# Altium project holographic_display_pcb_2.PrjPcb
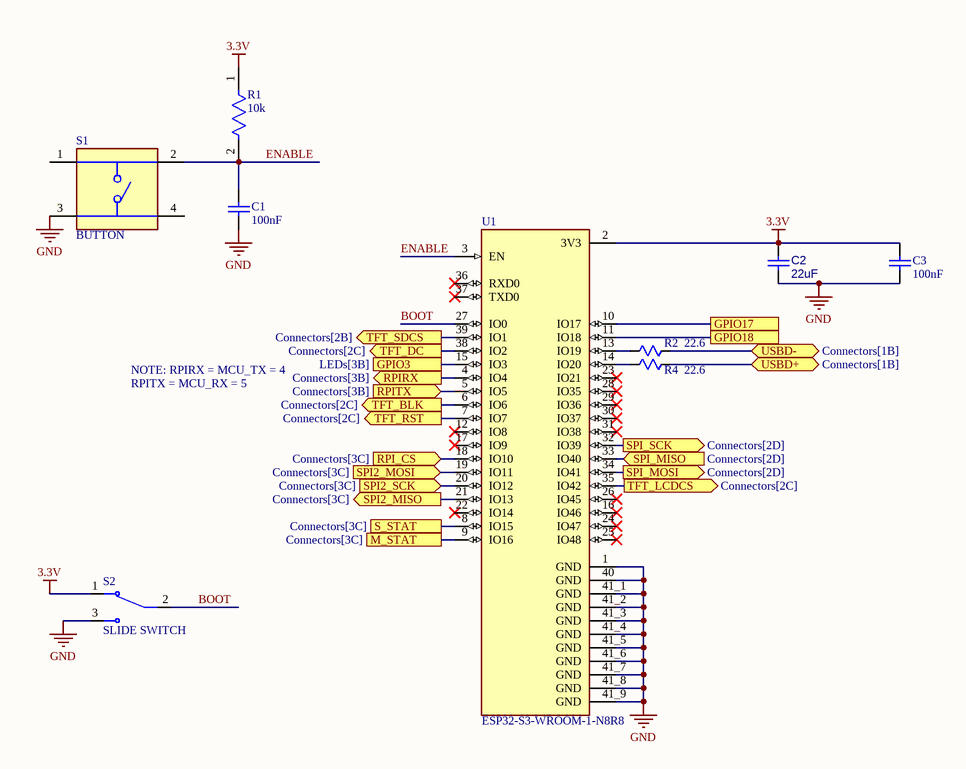
[diagram p0: MCU.SchDoc]
4 sheets, 32 parts. Net scope: flat (ports and power ports of the same name join across sheets).
Board files: PCB.PcbDoc, PCB1.PcbDoc
Sheets:
  MCU.SchDoc
  Connectors.SchDoc
  TLV62569.SchDoc
  LEDs.SchDoc

## Sheet MCU.SchDoc
size A; SheetNumber: 1; SheetTotal: 4

### Parts
C1  100nF  [CAPC1608X90X35LL10T15]
C2  22uF  [CAPC1608X09N]
C3  100nF  [CAPC1608X90X35LL10T15]
R1  10k  [FP-CRGP0603-IPC_C]
R2  22.6  [RESC1608X06N]
R4  22.6  [RESC1608X06N]
S1  BUTTON  [SW_TS02-66-43-BK-100-SCR-D]
S2  SLIDE SWITCH  [SW_SLW-883935-2A-D]
U1  ESP32-S3-WROOM-1-N8R8  [XCVR_ESP32S3WROOM1N8R8]

### Ports
GPIO3 (see LEDs[3B]), GPIO17, GPIO18, M_STAT (see Connectors[3C]), RPI_CS (in, see Connectors[3C]), RPIRX (out, see Connectors[3B]), RPITX (in, see Connectors[3B]), S_STAT (see Connectors[3C]), SPI2_MISO (out, see Connectors[3C]), SPI2_MOSI (in, see Connectors[3C]), SPI2_SCK (in, see Connectors[3C]), SPI_MISO (in, see Connectors[2D]), SPI_MOSI (out, see Connectors[2D]), SPI_SCK (out, see Connectors[2D]), TFT_BLK (out, see Connectors[2C]), TFT_DC (out, see Connectors[2C]), TFT_LCDCS (out, see Connectors[2C]), TFT_RST (out, see Connectors[2C]), TFT_SDCS (out, see Connectors[2B]), USBD+ (bidir, see Connectors[1B]), USBD- (bidir, see Connectors[1B])

### Nets
3.3V: C2.2 C3.2 R1.1 S2.1 U1.2(3V3)
GND: C1.1 C2.1 C3.1 S1.3 S2.3 U1.1(GND) U1.40(GND) U1.41_1(GND) U1.41_2(GND) U1.41_3(GND) U1.41_4(GND) U1.41_5(GND) U1.41_6(GND) U1.41_7(GND) U1.41_8(GND) U1.41_9(GND)
BOOT: S2.2 U1.27(IO0)
ENABLE: C1.2 R1.2 S1.2 U1.3(EN)
USB_D_N: R2.2 ; port USBD-
USB_D_P: R4.2 ; port USBD+
NetJ2_07: U1.5(IO5) ; port RPITX
NetJ2_09: U1.4(IO4) ; port RPIRX
NetJ2_17: U1.9(IO16) ; port M_STAT
NetJ2_20: U1.19(IO11) ; port SPI2_MOSI
NetJ2_21: U1.8(IO15) ; port S_STAT
NetJ2_22: U1.21(IO13) ; port SPI2_MISO
NetJ2_23: U1.18(IO10) ; port RPI_CS
NetJ2_24: U1.20(IO12) ; port SPI2_SCK
NetJ3_2: U1.39(IO1) ; port TFT_SDCS
NetJ3_11: U1.6(IO6) ; port TFT_BLK
NetJ3_12: U1.7(IO7) ; port TFT_RST
NetJ3_13: U1.38(IO2) ; port TFT_DC
NetJ3_14: U1.35(IO42) ; port TFT_LCDCS
NetJ3_15: U1.34(IO41) ; port SPI_MOSI
NetJ3_16: U1.33(IO40) ; port SPI_MISO
NetJ3_17: U1.32(IO39) ; port SPI_SCK
NetR2_1: R2.1 U1.13(IO19)
NetR4_1: R4.1 U1.14(IO20)
NetR10_1: U1.15(IO3) ; port GPIO3
NetU1_10: U1.10(IO17) ; port GPIO17
NetU1_11: U1.11(IO18) ; port GPIO18

Not connected (* = marked no-connect by the designer): S1 1 4; U1 12(IO8)* 16(IO46)* 17(IO9)* 22(IO14)* 23(IO21)* 24(IO47)* 25(IO48)* 26(IO45)* 28(IO35)* 29(IO36)* 30(IO37)* 31(IO38)* 36(RXD0)* 37(TXD0)*

### Notes on the sheet
- NOTE: RPIRX = MCU_TX = 4
- RPITX = MCU_RX = 5

### Library data of the parts
C1 C3 = CMP-2006-02868-1: Part Number: GRM188R71E104KA01D; Manufacturer: Murata
C2 = CMP-003-000012-1: CAP CER 22uF 10V X5R Symbols/Capacitor-Generic.SchLib; Part Number: CAP-0603-000010; Manufacturer Part Number 1: GRM187R61A226ME15#; Manufacturer 1: Murata; Value: 22µF; Tolerance: 20%; Voltage: 10V; Symbol Path: Symbols/Capacitor-Generic.SchLib; Temperature Characteristic: X5R
R1 = CMP-03211-004414-1: CRGP 0603 10K 1%; Manufacturer Part Number: CRGP0603F10K; Manufacturer: TE; Voltage Rating: 50V; Power Rating: 0.25W; Value: 10KΩ; Tolerance: 0.01; Temperature Coefficient: ±100ppm/°C; Octopart: https://octopart.com/crgp0603f10k-te+connectivity-91018721; Temperature Range Low: -55°C; Temperature Range High: +155°C; Device Class L3: Chip SMD Resistors; Package: CRGP0603; Height: 0.55mm; Series: CRGP; RoHS: TRUE; Composition: Thick Film; Digikey Description: CRGP 0603 10K 1%; Ipc Land Pattern Name: RESC16080X45; Mouser Description: Res, 10K, 1%, 0.25W, 0603, Thick Film; ComponentLink2Description: Datasheet; ComponentLink2URL: https://www.te.com/commerce/DocumentDelivery/DDEController?Action=srchrtrv&DocNm=9-1773463-9&DocType=DS&DocLang=English; Temperature: -55°C to +155°C; Device Class L1: Passive Components; Lead Free: Yes; Ambient Temperature Range High: +70°C; Device Class L2: Resistors; Automotive: No; Category: Res; Resistance: 10KΩ
R2 R4 = CMP-007-000132-1: RES 22.6 OHM 1% 1/10W 0603; Part Number: RES-0603-22R6-001; Manufacturer Part Number 1: RC0603FR-0722R6L; Manufacturer 1: Yageo; Value: 22.6R; Tolerance: 0.01%; Symbol Path: Symbols/Resistor_Generic.SchLib; Manufacturer 3: Vishay Dale; Manufacturer Part Number 3: CRCW060322R6FKED; Manufacturer 2: Stackpole Electronics; Manufacturer Part Number 2: RMCF0603FT22R6
S1 = CMP-00010-2: Switch Tactile OFF (ON) SPST Round Button PC Pins 0.05A 12VDC 100000Cycles 1N Thru-Hole Bag; Insulation Resistance: 100MΩ; Number of Positions: 1; Operating Force: 980mN; Electrical Life: 100kcycles; Max Current Rating: 50mA; Max Voltage Rating (DC): 12V; Min Operating Temperature: -30°C; Height: 3.5mm; Housing Material: Stainless Steel; Throw Configuration: SPST; Contact Plating: Silver; REACH SVHC: Yes; Lifecycle Status: Production; Terminal Material: Brass; Color: Black; Length: 6mm; Contact Resistance: 100mΩ; Max Operating Temperature: 80°C; Schedule B: 8536509030, 8536509065, 8536509065; RoHS: Compliant
S2 = CMP-00009-3: Switch Slide ON ON SPDT Raised Slide 0.5A 30VDC 10000Cycles PC Pins Thru-Hole Box; Number of Positions: 2; REACH SVHC: Yes; RoHS: Compliant; Lifecycle Status: Production
U1 = ESP32-S3-WROOM-1-N8R8: Bluetooth, WiFi 802.11b/g/n, Bluetooth v5.0 Transceiver Module 2.4GHz PCB Trace Surface Mount; MF: Espressif Systems; Package: None; Price: None; Check_prices: https://www.snapeda.com/parts/ESP32-S3-WROOM-1-N8R8/Espressif+Systems/view-part/?ref=eda; Value: *; SnapEDA_Link: https://www.snapeda.com/parts/ESP32-S3-WROOM-1-N8R8/Espressif+Systems/view-part/?ref=snap; MP: ESP32-S3-WROOM-1-N8R8; Availability: In Stock; Purchase-URL: https://pricing.snapeda.com/search?q=ESP32-S3-WROOM-1-N8R8&ref=eda

## Sheet Connectors.SchDoc
size A; SheetNumber: 2; SheetTotal: 4
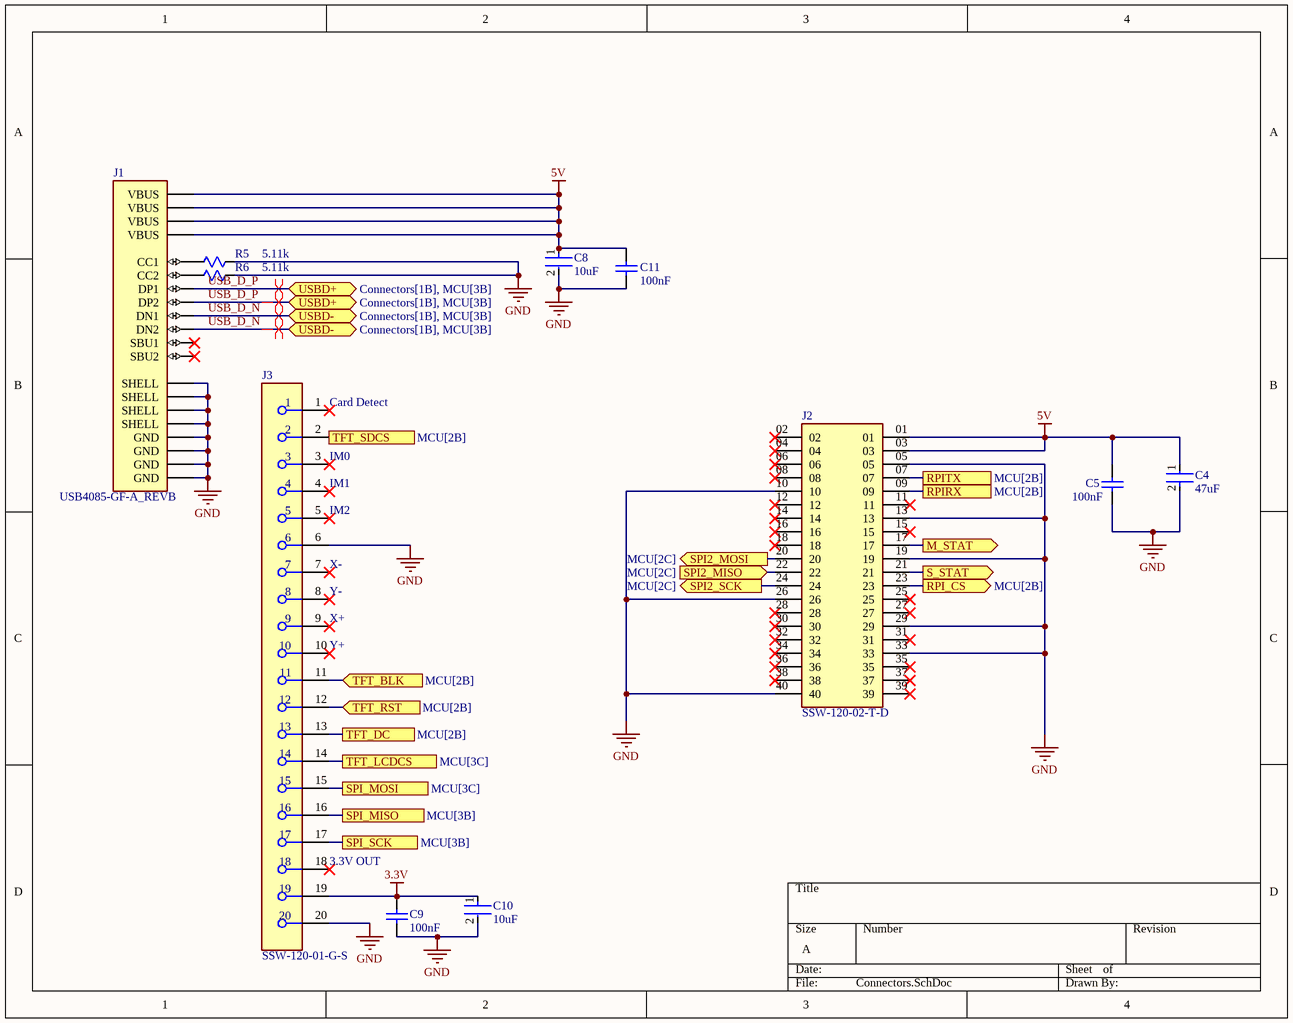
[diagram p1: Connectors.SchDoc]

### Parts
C4  47uF  [FP-GRM31C-0_3-e0_3_0_8-IPC_C]
C5  100nF  [CAPC1608X90X35LL10T15]
C8  10uF  [FP-GRM21B-0_1-IPC_C]
C9  100nF  [CAPC1608X90X35LL10T15]
C10  10uF  [FP-GRM21B-0_1-IPC_C]
C11  100nF  [CAPC1608X90X35LL10T15]
J1  USB4085-GF-A_REVB  [GCT_USB4085-GF-A_REVB]
J2  SSW-120-02-T-D  [SAMTEC_SSW-120-02-T-D]
J3  SSW-120-01-G-S  [FP-SSW-120-01-G-S-MFG]
R5  5.11k  [RESC1608X06N]
R6  5.11k  [RESC1608X06N]

### Ports
M_STAT (out), RPI_CS (out, see MCU[2B]), RPIRX (see MCU[2B]), RPITX (see MCU[2B]), S_STAT (out), SPI2_MISO (in, see MCU[2C]), SPI2_MOSI (out, see MCU[2C]), SPI2_SCK (out, see MCU[2C]), SPI_MISO (see MCU[3B]), SPI_MOSI (see MCU[3C]), SPI_SCK (see MCU[3B]), TFT_BLK (in, see MCU[2B]), TFT_DC (see MCU[2B]), TFT_LCDCS (see MCU[3C]), TFT_RST (in, see MCU[2B]), TFT_SDCS (see MCU[2B]), USBD+ (bidir, see Connectors[1B], MCU[3B]), USBD- (bidir, see Connectors[1B], MCU[3B])

### Nets
3.3V: C9.2 C10.1 J3.19
5V: C4.1 C5.2 C8.1 C11.2 J1.A4(VBUS) J1.A9(VBUS) J1.B4(VBUS) J1.B9(VBUS) J2.01 J2.03
GND: C4.2 C5.1 C8.2 C9.1 C10.2 C11.1 J1.A1(GND) J1.A12(GND) J1.B1(GND) J1.B12(GND) J1.S1(SHELL) J1.S2(SHELL) J1.S3(SHELL) J1.S4(SHELL) J2.05 J2.10 J2.13 J2.19 J2.26 J2.29 J2.33 J2.40 J3.6 J3.20 R5.2 R6.2
USB_D_N: J1.A7(DN1) J1.B7(DN2) ; port USBD-
USB_D_P: J1.A6(DP1) J1.B6(DP2) ; port USBD+
NetJ1_A5: J1.A5(CC1) R5.1
NetJ1_B5: J1.B5(CC2) R6.1
NetJ2_07: J2.07 ; port RPITX
NetJ2_09: J2.09 ; port RPIRX
NetJ2_17: J2.17 ; port M_STAT
NetJ2_20: J2.20 ; port SPI2_MOSI
NetJ2_21: J2.21 ; port S_STAT
NetJ2_22: J2.22 ; port SPI2_MISO
NetJ2_23: J2.23 ; port RPI_CS
NetJ2_24: J2.24 ; port SPI2_SCK
NetJ3_2: J3.2 ; port TFT_SDCS
NetJ3_11: J3.11 ; port TFT_BLK
NetJ3_12: J3.12 ; port TFT_RST
NetJ3_13: J3.13 ; port TFT_DC
NetJ3_14: J3.14 ; port TFT_LCDCS
NetJ3_15: J3.15 ; port SPI_MOSI
NetJ3_16: J3.16 ; port SPI_MISO
NetJ3_17: J3.17 ; port SPI_SCK

Not connected (* = marked no-connect by the designer): J1 A8(SBU1)* B8(SBU2)*; J2 02* 04* 06* 08* 11* 12* 14* 15* 16* 18* 25* 27* 28* 30* 31* 32* 34* 35* 36* 37* 38* 39*; J3 1* 3* 4* 5* 7* 8* 9* 10* 18*

### Layout directives
differential pair: USB_D_N, USB_D_P

### Notes on the sheet
- (near J3) Card Detect
- (near J3) IM0
- (near J3) IM1
- (near J3) IM2
- (near J3) X-
- (near J3) Y-
- (near J3) X+
- (near J3) Y+
- (near J3) 3.3V OUT

### Library data of the parts
C4 = CMP-06035-011430-1: Chip Multilayer Ceramic Capacitors for General Purpose, 1206, 47uF, X5R, 15%, 20%, 16V; Capacitance: 47uF; Length: 3.2mm; Thickness: 1.6mm; Width: 1.6mm; Voltage Rating (DC): 16V; Tolerance: 20%; Dielectric: X5R
C5 C9 C11 = CMP-2006-02868-1: as C1 on sheet MCU
C8 C10 = CMP-2007-03453-2: Chip Multilayer Ceramic Capacitors for General Purpose, 0805, 10uF, X5R, 15%, 10%, 16V; Radiation Hardening: No; Thickness: 0.053inch; Voltage Rating (DC): 16V; Lead Free: Lead Free; Package Quantity: 1; Width: 1.25mm; Case Code (Imperial): 0805; Depth: 1.25mm; Packaging: Tape and Reel; Dielectric: X5R; Max Operating Temperature: 85°C; Tolerance: 10%; Voltage Rating: 16V; Voltage: 16V; Capacitance: 10uF; Height: 1.25mm; Case Code (Metric): 2012; Material: Ceramic; Mount: Surface Mount; Case/Package: 0805; REACH SVHC: No SVHC; Length: 2mm; Min Operating Temperature: -55°C; Termination: SMD/SMT
J1 = USB4085-GF-A_REVB: USB-C (USB TYPE-C) USB 2.0 æ’åº§è¿žæŽ¥å™¨ 24 (16+8 Dummy) ä½é€šå­”ã€ç›´è§’ã€ä½Žæˆæœ¬ã€3.46mm å¤–å½¢ã€16 é’ˆã€æ°´å¹³ã€é¡¶éƒ¨å®‰è£…; MF: Global Connector Technology; SnapEDA_Link: https://www.snapeda.com/parts/USB4085-GF-A/Global+Connector+Technology/view-part/?ref=snap; Package: None; Value: *; MP: USB4085-GF-A; Check_prices: https://www.snapeda.com/parts/USB4085-GF-A/Global+Connector+Technology/view-part/?ref=eda
J2 = SSW-120-02-T-D: 40 Position Receptacle Connector 0.100 (2.54mm) Through Hole Tin; MF: Samtec Inc.; SnapEDA_Link: https://www.snapeda.com/parts/SSW-120-02-T-D/Samtec+Inc./view-part/?ref=snap; Package: None; Value: *; MP: SSW-120-02-T-D; Check_prices: https://www.snapeda.com/parts/SSW-120-02-T-D/Samtec+Inc./view-part/?ref=eda
J3 = CMP-00575-00296075-1: SSW-120-01-G-S SSW - Samtec 2.54mm Single Row Straight Socket Strip 8.5 Profile (mcv)(TO22); NexarPartId: 296075; Manufacturer Lifecycle Status: PRODUCTION; Number of Contacts: 20; Gender: Receptacle; Connector Type: Receptacle, Socket; Contact Resistance: 10mΩ; Voltage Rating: 550V; Voltage Rating (DC): 655V; Voltage Rating (AC): 465V; Current Rating: 6.9A; Lead Length: 2.64mm; Housing Material: Polymer; Lead Free: Lead Free; Depth: 2.41mm; Termination: Solder; Radiation Hardening: No; Contact Material: Bronze; Lead Pitch: 2.54mm; Number of Rows: 1; Orientation: Straight; Housing Color: Black; Max Voltage Rating (AC): 550V; RoHS: Compliant; Pitch: 2.54mm; Lifecycle Status: Production; Mount: Through Hole; Color: Black; REACH SVHC: No SVHC; Min Operating Temperature: -55°C; Contact Plating: Gold; Length: 51.31mm; Max Operating Temperature: 125°C; Max Current Rating: 6.9A; Number of Positions: 20
R5 R6 = CMP-007-000358-1: RES 5.11K OHM 1% 1/10W 0603; Manufacturer Part Number 1: RC0603FR-075K11L; Manufacturer 1: Yageo; Part Number: RES-0603-5K11-001; Tolerance: 0.01%; Manufacturer 2: Stackpole Electronics; Manufacturer Part Number 3: CRCW06035K11FKED; Manufacturer 3: Vishay Dale; Value: 5.11K; Symbol Path: Symbols/Resistor_Generic.SchLib; Manufacturer Part Number 2: RMCF0603FT5K11

## Sheet TLV62569.SchDoc
size A; SheetNumber: 3; SheetTotal: 4
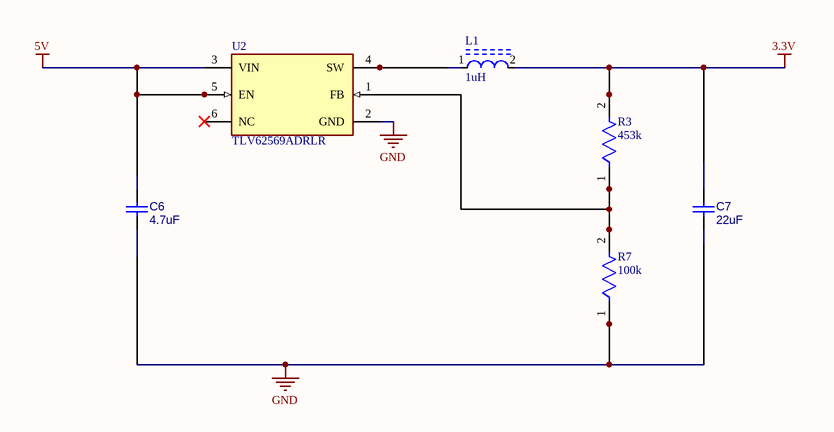
[diagram p2: TLV62569.SchDoc]

### Parts
C6  4.7uF  [CAPC1608X09N]
C7  22uF  [CAPC1608X09N]
L1  1uH  [FP-SRN8040-MFG]
R3  453k  [FP-CRCW0402-e3-MFG]
R7  100k  [FP-CRCW0402-e3-IPC_C]
U2  TLV62569ADRLR  [FP-DRL0006A-MFG]

### Nets
3.3V: C7.2 L1.2 R3.2
5V: C6.2 U2.3(VIN) U2.5(EN)
GND: C6.1 C7.1 R7.1 U2.2(GND)
NetL1_1: L1.1 U2.4(SW)
NetR3_1: R3.1 R7.2 U2.1(FB)

Not connected (* = marked no-connect by the designer): U2 6(NC)*

### Library data of the parts
C6 = CMP-003-000096-1: CAP CER 4.7uF 25V X5R Symbols/Capacitor-Generic.SchLib; Manufacturer 1: Murata; Manufacturer Part Number 1: GRM188R61E475KE11#; Part Number: CAP-0603-000094; Tolerance: 10%; Value: 4.7µF; Symbol Path: Symbols/Capacitor-Generic.SchLib; Voltage: 25V; Temperature Characteristic: X5R
C7 = CMP-003-000012-1: as C2 on sheet MCU; Voltage: 10V; Symbol Path: Symbols/Capacitor-Generic.SchLib; Temperature Characteristic: X5R
L1 = CMP-07248-000040-1: FIXED IND 1UH 7.8A 10 MOHM SMD; Inductance Tolerance: 30%; DC Resistance (DCR): 10mR; Self Resonant Frequency: 75MHz; Shielding: Shielded; Saturation Current: 11A; Core Material: Ferrite; Test Frequency: 100kHz; Current Rating: 7.8A; Composition: Wirewound; Height: 4mm; Number of Pins: 2; Inductance: 1uH; Depth: 8.3mm; REACH SVHC: No SVHC; Length: 8mm; DC Current: 7.8A; Package Quantity: 1000; Height - Seated (Max): 0.157inch; Termination: SMD/SMT; Packaging: Tape and Reel; Max DC Current: 7.8A; Min Operating Temperature: -40°C; Max Operating Temperature: 125°C; Case/Package: Nonstandard; Mount: Surface Mount; Military Standard: Not; RMS Current (Irms): 7.8A; Width: 8mm; Tolerance: 30%
R3 = CMP-2002-00012-2: RES Thick Film, 453kΩ, 1%, 0.063W, 100ppm/°C, 0402; Resistance: 453kR; Voltage Rating (DC): 50V; Power Rating: 63mW; Features: Automotive AEC-Q200; Termination: SMD/SMT; Weight: 2.3E-05oz; Resistor Type: Thick Film; Size Code: 0402; Height: 0.016inch; RoHS Compliant: Yes; Resistance Tolerance: 1%; Construction: Rectangular; Radiation Hardening: No; Temperature Coefficient: 100ppm/°C; Series: CRCW; Depth: 0.5mm; Lead Free: Lead Free; Min Operating Temperature: -55°C; Package Quantity: 10; Length: 1mm; Case Code (Metric): 1005; Tolerance: 1%; Max Operating Temperature: 155°C; Voltage Rating: 50V; Packaging: Tape and Reel; Number of Pins: 2; Case Code (Imperial): 0402; Case/Package: 0402; Number of Terminations: 2; Contact Plating: Tin; Military Standard: Not; Max Power Dissipation: 63mW; Width: 0.5mm
R7 = CMP-2002-08123-3: RES Thick Film, 100kΩ, 1%, 0.063W, 100ppm/°C, 0402; Power Rating: 63mW; Resistance: 100kR; Voltage Rating (DC): 50V; Lead Free: Lead Free; Height: 0.35mm; Contact Plating: Tin; Min Operating Temperature: -55°C; Package Quantity: 10000; Case/Package: 0402; Temperature Coefficient: 100ppm/°C; Number of Terminations: 2; Packaging: Tape and Reel; Max Power Dissipation: 63mW; Case Code (Metric): 1005; Mount: Surface Mount; Width: 0.02inch; Termination: SMD/SMT; Length: 1mm; Number of Pins: 2; Weight: 2.3E-05oz; Radiation Hardening: No; Tolerance: 1%; Military Standard: Not; Features: Automotive AEC-Q200; Depth: 0.5mm; Composition: Thick Film; Max Operating Temperature: 155°C; Voltage Rating: 50V; Case Code (Imperial): 0402
U2 = CMP-04918-000167-1: IC REG BUCK ADJ 2A SOT563; Synchronous Rectifier: Yes; Output Configuration: Positive; Max Output Voltage: 5.5V; Switching Frequency: 1.5MHz; Min Input Voltage: 2.5V; Output Type: Adjustable; Min Output Voltage: 600mV; Case/Package: SOT-563; Output Current: 2A; Max Input Voltage: 5.5V; Mount: Surface Mount; Max Operating Temperature: 125°C; Min Operating Temperature: -40°C; Packaging: Tape and Reel

## Sheet LEDs.SchDoc
size A; SheetNumber: 4; SheetTotal: 4
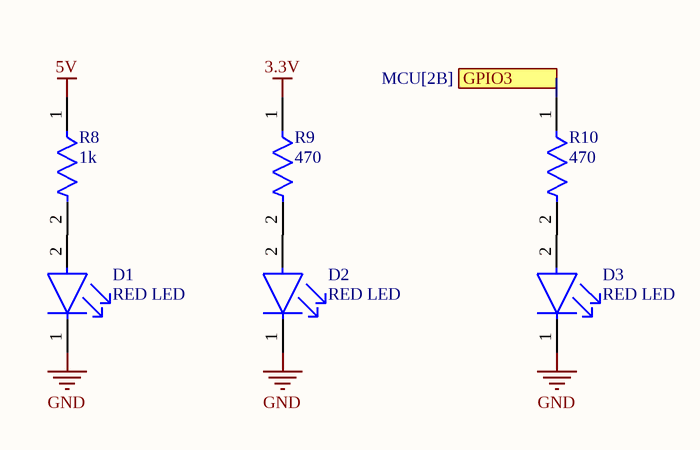
[diagram p3: LEDs.SchDoc]

### Parts
D1  RED LED  [FP-APTD1608SEC-J3-MFG]
D2  RED LED  [FP-APTD1608SEC-J3-MFG]
D3  RED LED  [FP-APTD1608SEC-J3-MFG]
R8  1k  [FP-RNCP0603-IPC_C]
R9  470  [FP-AC0603-IPC_A]
R10  470  [FP-AC0603-IPC_A]

### Ports
GPIO3 (see MCU[2B])

### Nets
3.3V: R9.1
5V: R8.1
GND: D1.1(C) D2.1(C) D3.1(C)
NetD1_2: D1.2(A) R8.2
NetD2_2: D2.2(A) R9.2
NetD3_2: D3.2(A) R10.2
NetR10_1: R10.1 ; port GPIO3

### Library data of the parts
D1-D3 = CMP-44529-000051-1: LED RED CLEAR CHIP SMD; Number of LEDs: 1; Luminous Intensity: 900mcd; Test Current: 20mA; Lens Color: Colorless; Dominant Wavelength: 625nm; Viewing Angle: 60°; Forward Voltage: 2.2V; Case Code (Metric): 1608; Max Operating Temperature: 85°C; Color: Red; Lead Free: Lead Free; Height: 0.95mm; Forward Current: 20mA; Package Quantity: 2000; Lens Style: Clear; Min Operating Temperature: -40°C; Case/Package: 0603; Illumination Color: Red; Packaging: Tape and Reel; Case Code (Imperial): 0603; Length: 1.6mm; Width: 0.8mm; Mount: Surface Mount; Lens Transparency: Clear; Number of Pins: 4
R8 = CMP-26527-006179-1: 1kΩ ±1% 0.125W 0603 High Power Anti-Sulfur Thin Film Chip Resistor; Temperature Coefficient: 100ppm/°C; Max Power Dissipation: 125mW; Resistance: 1kR; Case/Package: 0603; Width: 0.031inch; Tolerance: 1%; Case Code (Imperial): 0603; RoHS Compliant: Yes; Min Operating Temperature: -55°C; Resistor Type: Thin Film; Features: Moisture Resistant; Length: 0.059inch; Mount: Surface Mount; Case Code (Metric): 1608; Height: 0.02inch; Max Operating Temperature: 155°C; Packaging: Tape and Reel; Series: RNCP; Number of Terminations: 2
R9 R10 = CMP-03412-002877-2: RES 470Ω 1.00% 0.1W 0603; Tolerance: 1%; Resistance: 470R; Case/Package: 0603; RoHS Compliant: Yes

## Nets that join several sheets
3.3V: MCU (5 pins), Connectors (C9.2 C10.1 J3.19), TLV62569 (C7.2 L1.2 R3.2), LEDs (R9.1)
5V: Connectors (10 pins), TLV62569 (C6.2 U2.3 U2.5), LEDs (R8.1)
GND: MCU (16 pins), Connectors (26 pins), TLV62569 (C6.1 C7.1 R7.1 U2.2), LEDs (D1.1 D2.1 D3.1)
NetJ2_07: MCU (U1.5), Connectors (J2.07)
NetJ2_09: MCU (U1.4), Connectors (J2.09)
NetJ2_17: MCU (U1.9), Connectors (J2.17)
NetJ2_20: MCU (U1.19), Connectors (J2.20)
NetJ2_21: MCU (U1.8), Connectors (J2.21)
NetJ2_22: MCU (U1.21), Connectors (J2.22)
NetJ2_23: MCU (U1.18), Connectors (J2.23)
NetJ2_24: MCU (U1.20), Connectors (J2.24)
NetJ3_2: MCU (U1.39), Connectors (J3.2)
NetJ3_11: MCU (U1.6), Connectors (J3.11)
NetJ3_12: MCU (U1.7), Connectors (J3.12)
NetJ3_13: MCU (U1.38), Connectors (J3.13)
NetJ3_14: MCU (U1.35), Connectors (J3.14)
NetJ3_15: MCU (U1.34), Connectors (J3.15)
NetJ3_16: MCU (U1.33), Connectors (J3.16)
NetJ3_17: MCU (U1.32), Connectors (J3.17)
NetR10_1: MCU (U1.15), LEDs (R10.1)
USB_D_N: MCU (R2.2), Connectors (J1.A7 J1.B7)
USB_D_P: MCU (R4.2), Connectors (J1.A6 J1.B6)